# Altium schematic sheet LEDs.SchDoc
size A4; SheetNumber: 2; SheetTotal: 2
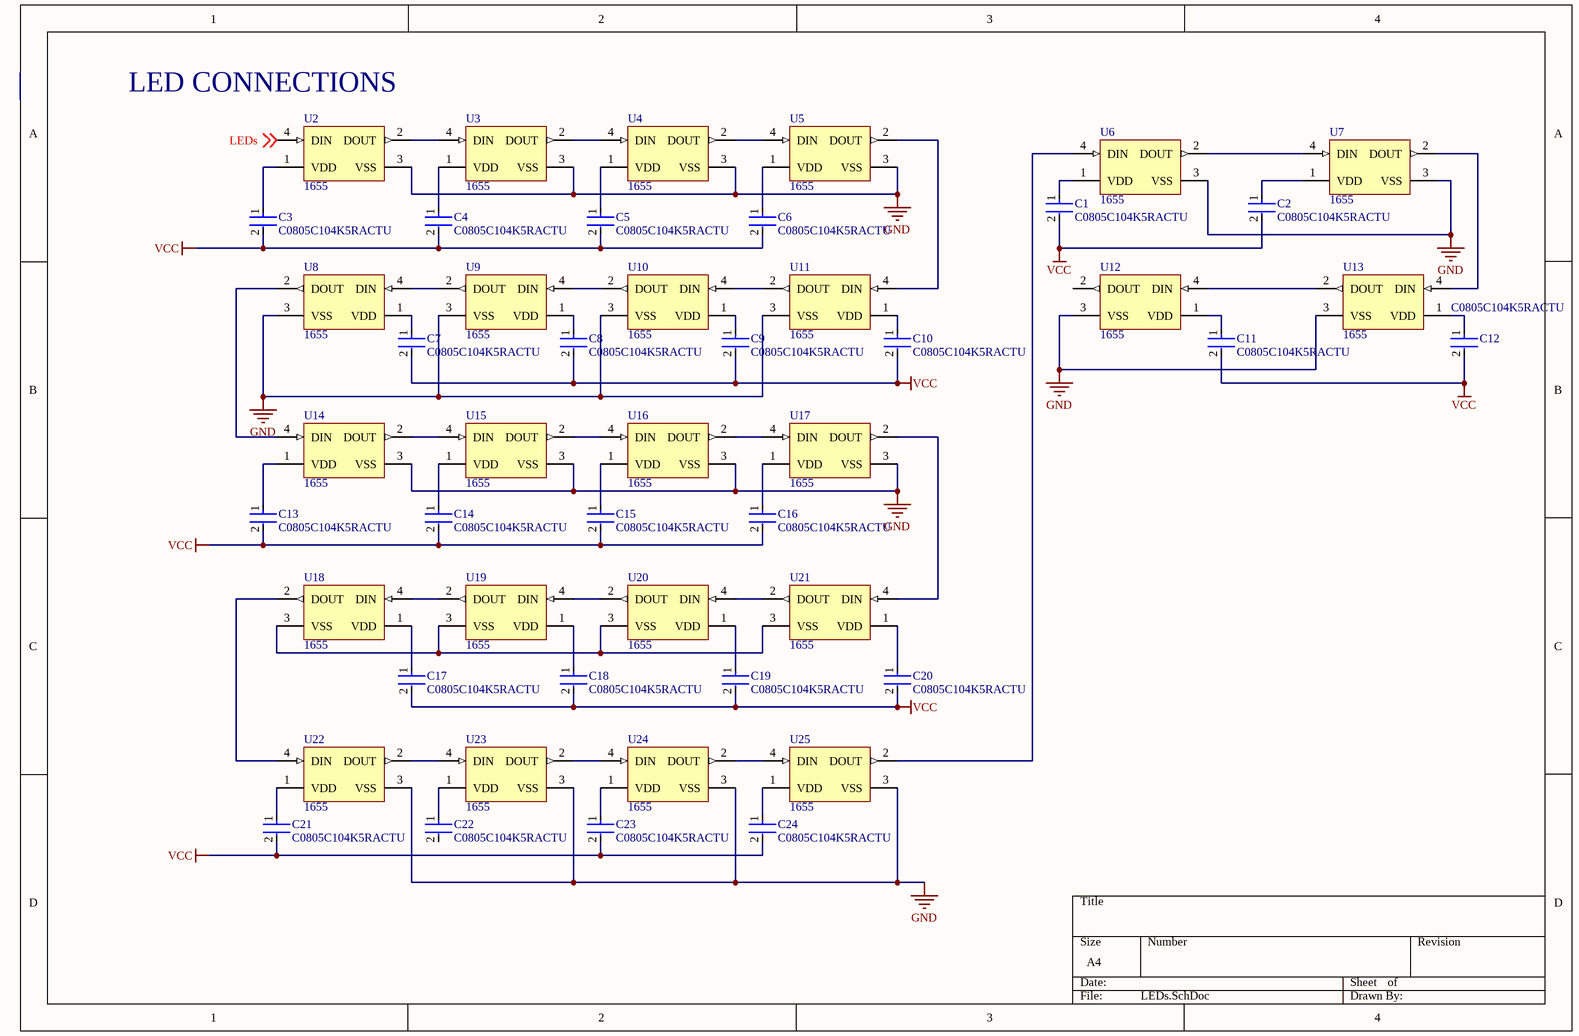
[diagram p0: LEDs.SchDoc]

## Parts
C1  C0805C104K5RACTU  [FP-C0805C-DN-MFG]
C2  C0805C104K5RACTU  [FP-C0805C-DN-MFG]
C3  C0805C104K5RACTU  [FP-C0805C-DN-MFG]
C4  C0805C104K5RACTU  [FP-C0805C-DN-MFG]
C5  C0805C104K5RACTU  [FP-C0805C-DN-MFG]
C6  C0805C104K5RACTU  [FP-C0805C-DN-MFG]
C7  C0805C104K5RACTU  [FP-C0805C-DN-MFG]
C8  C0805C104K5RACTU  [FP-C0805C-DN-MFG]
C9  C0805C104K5RACTU  [FP-C0805C-DN-MFG]
C10  C0805C104K5RACTU  [FP-C0805C-DN-MFG]
C11  C0805C104K5RACTU  [FP-C0805C-DN-MFG]
C12  C0805C104K5RACTU  [FP-C0805C-DN-MFG]
C13  C0805C104K5RACTU  [FP-C0805C-DN-MFG]
C14  C0805C104K5RACTU  [FP-C0805C-DN-MFG]
C15  C0805C104K5RACTU  [FP-C0805C-DN-MFG]
C16  C0805C104K5RACTU  [FP-C0805C-DN-MFG]
C17  C0805C104K5RACTU  [FP-C0805C-DN-MFG]
C18  C0805C104K5RACTU  [FP-C0805C-DN-MFG]
C19  C0805C104K5RACTU  [FP-C0805C-DN-MFG]
C20  C0805C104K5RACTU  [FP-C0805C-DN-MFG]
C21  C0805C104K5RACTU  [FP-C0805C-DN-MFG]
C22  C0805C104K5RACTU  [FP-C0805C-DN-MFG]
C23  C0805C104K5RACTU  [FP-C0805C-DN-MFG]
C24  C0805C104K5RACTU  [FP-C0805C-DN-MFG]
U2  1655  [ADA-RGB-1655_V]
U3  1655  [ADA-RGB-1655_V]
U4  1655  [ADA-RGB-1655_V]
U5  1655  [ADA-RGB-1655_V]
U6  1655  [ADA-RGB-1655_V]
U7  1655  [ADA-RGB-1655_V]
U8  1655  [ADA-RGB-1655_V]
U9  1655  [ADA-RGB-1655_V]
U10  1655  [ADA-RGB-1655_V]
U11  1655  [ADA-RGB-1655_V]
U12  1655  [ADA-RGB-1655_V]
U13  1655  [ADA-RGB-1655_V]
U14  1655  [ADA-RGB-1655_V]
U15  1655  [ADA-RGB-1655_V]
U16  1655  [ADA-RGB-1655_V]
U17  1655  [ADA-RGB-1655_V]
U18  1655  [ADA-RGB-1655_V]
U19  1655  [ADA-RGB-1655_V]
U20  1655  [ADA-RGB-1655_V]
U21  1655  [ADA-RGB-1655_V]
U22  1655  [ADA-RGB-1655_V]
U23  1655  [ADA-RGB-1655_V]
U24  1655  [ADA-RGB-1655_V]
U25  1655  [ADA-RGB-1655_V]

## Nets
GND: U2.3(VSS) U3.3(VSS) U4.3(VSS) U5.3(VSS) U6.3(VSS) U7.3(VSS) U8.3(VSS) U9.3(VSS) U10.3(VSS) U11.3(VSS) U12.3(VSS) U13.3(VSS) U14.3(VSS) U15.3(VSS) U16.3(VSS) U17.3(VSS) U22.3(VSS) U23.3(VSS) U24.3(VSS) U25.3(VSS)
VCC: C1.2 C2.2 C3.2 C4.2 C5.2 C6.2 C7.2 C8.2 C9.2 C10.2 C11.2 C12.2 C13.2 C14.2 C15.2 C16.2 C17.2 C18.2 C19.2 C20.2 C21.2 C23.2 C24.2
LEDs: U2.4(DIN) ; off-sheet LEDs
NetC1_1: C1.1 U6.1(VDD)
NetC2_1: C2.1 U7.1(VDD)
NetC3_1: C3.1 U2.1(VDD)
NetC4_1: C4.1 U3.1(VDD)
NetC5_1: C5.1 U4.1(VDD)
NetC6_1: C6.1 U5.1(VDD)
NetC7_1: C7.1 U8.1(VDD)
NetC8_1: C8.1 U9.1(VDD)
NetC9_1: C9.1 U10.1(VDD)
NetC10_1: C10.1 U11.1(VDD)
NetC11_1: C11.1 U12.1(VDD)
NetC12_1: C12.1 U13.1(VDD)
NetC13_1: C13.1 U14.1(VDD)
NetC14_1: C14.1 U15.1(VDD)
NetC15_1: C15.1 U16.1(VDD)
NetC16_1: C16.1 U17.1(VDD)
NetC17_1: C17.1 U18.1(VDD)
NetC18_1: C18.1 U19.1(VDD)
NetC19_1: C19.1 U20.1(VDD)
NetC20_1: C20.1 U21.1(VDD)
NetC21_1: C21.1 U22.1(VDD)
NetC22_1: C22.1 U23.1(VDD)
NetC23_1: C23.1 U24.1(VDD)
NetC24_1: C24.1 U25.1(VDD)
NetU2_2: U2.2(DOUT) U3.4(DIN)
NetU3_2: U3.2(DOUT) U4.4(DIN)
NetU4_2: U4.2(DOUT) U5.4(DIN)
NetU5_2: U5.2(DOUT) U11.4(DIN)
NetU6_2: U6.2(DOUT) U7.4(DIN)
NetU6_4: U6.4(DIN) U25.2(DOUT)
NetU7_2: U7.2(DOUT) U13.4(DIN)
NetU8_2: U8.2(DOUT) U14.4(DIN)
NetU8_4: U8.4(DIN) U9.2(DOUT)
NetU9_4: U9.4(DIN) U10.2(DOUT)
NetU10_4: U10.4(DIN) U11.2(DOUT)
NetU12_4: U12.4(DIN) U13.2(DOUT)
NetU14_2: U14.2(DOUT) U15.4(DIN)
NetU15_2: U15.2(DOUT) U16.4(DIN)
NetU16_2: U16.2(DOUT) U17.4(DIN)
NetU17_2: U17.2(DOUT) U21.4(DIN)
NetU18_2: U18.2(DOUT) U22.4(DIN)
NetU18_3: U18.3(VSS) U19.3(VSS) U20.3(VSS) U21.3(VSS)
NetU18_4: U18.4(DIN) U19.2(DOUT)
NetU19_4: U19.4(DIN) U20.2(DOUT)
NetU20_4: U20.4(DIN) U21.2(DOUT)
NetU22_2: U22.2(DOUT) U23.4(DIN)
NetU23_2: U23.2(DOUT) U24.4(DIN)
NetU24_2: U24.2(DOUT) U25.4(DIN)

Not connected (* = marked no-connect by the designer): C22 2; U12 2(DOUT)

## Notes on the sheet
- (near U2) LED CONNECTIONS

## Library data of the parts
C1-C24 = CMP-2007-00279-2: CAP CER 0.1UF 50V X7R 0805; Manufacturer: KEMET; Value: 0.10 μF; Tolerance: 0.1; Temperature Coefficient: 30ppm/°C; Material: Ceramic; Manufacturer Part Number: C0805C104K5RACTU; Device Class L2: Capacitors; Temperature Range Low: -55°C; Voltage Rating: 50 V; Digikey Description: CAP CER 0.1UF 50V X7R 0805; Category: Cap; ComponentLink2Description: Datasheet; Octopart: https://octopart.com/c0805c104k5ractu-kemet-143926; RoHS: TRUE; ComponentLink2URL: https://content.kemet.com/datasheets/KEM_C1003_C0G_SMD.pdf; Temperature Characteristic: X7R; Temperature: -55°C to +125°C; Height: 0.88mm; Temperature Range High: +125°C; Device Class L1: Passive Components; Automotive: No; Lead Free: Yes; Ipc Land Pattern Name: CAPC200125X78; Device Class L3: Ceramic Capacitors; Mouser Description: Cap Ceramic 0.1uF 50V X7R 10% SMD 2.0 x 1.2 mm 125 C Paper T/R; Capacitance: 0.10 μF; Package: C0805C-DN
U2-U25 = CMP-2000-05026-1: Intelligent Control LED Integrated Light Source, 3.5 to 5.3 V, -25 to 80 degC, 4-Pin SMD, RoHS, Tape and Reel; Manufacturer: Adafruit-Industries-LLC; Number of LEDs: 10; Configuration: Discrete; Utilized LED: WS2812(5050); Datasheet URL: http://datasheet.octopart.com/ADA1655-Adafruit-Industries-datasheet-32028139.pdf; Series: Neopixel; Interface: -; Package Description: 4-Pin Surface Mount Device, Body 5 x 5 mm; Color: Red,Green,Blue(RGB); Category: Optoelectronics; Controller Type: -; Package Reference: 1655; Manufacturer URL: https://www.adafruit.com/; Mounting Type: SurfaceMount; Datasheet Version: May-13; Size / Dimension: 5.00mmLx5.00mmW; Family: Addressable,Specialty